# EAGLE design ADAP030 (EAGLE 7.6.0)
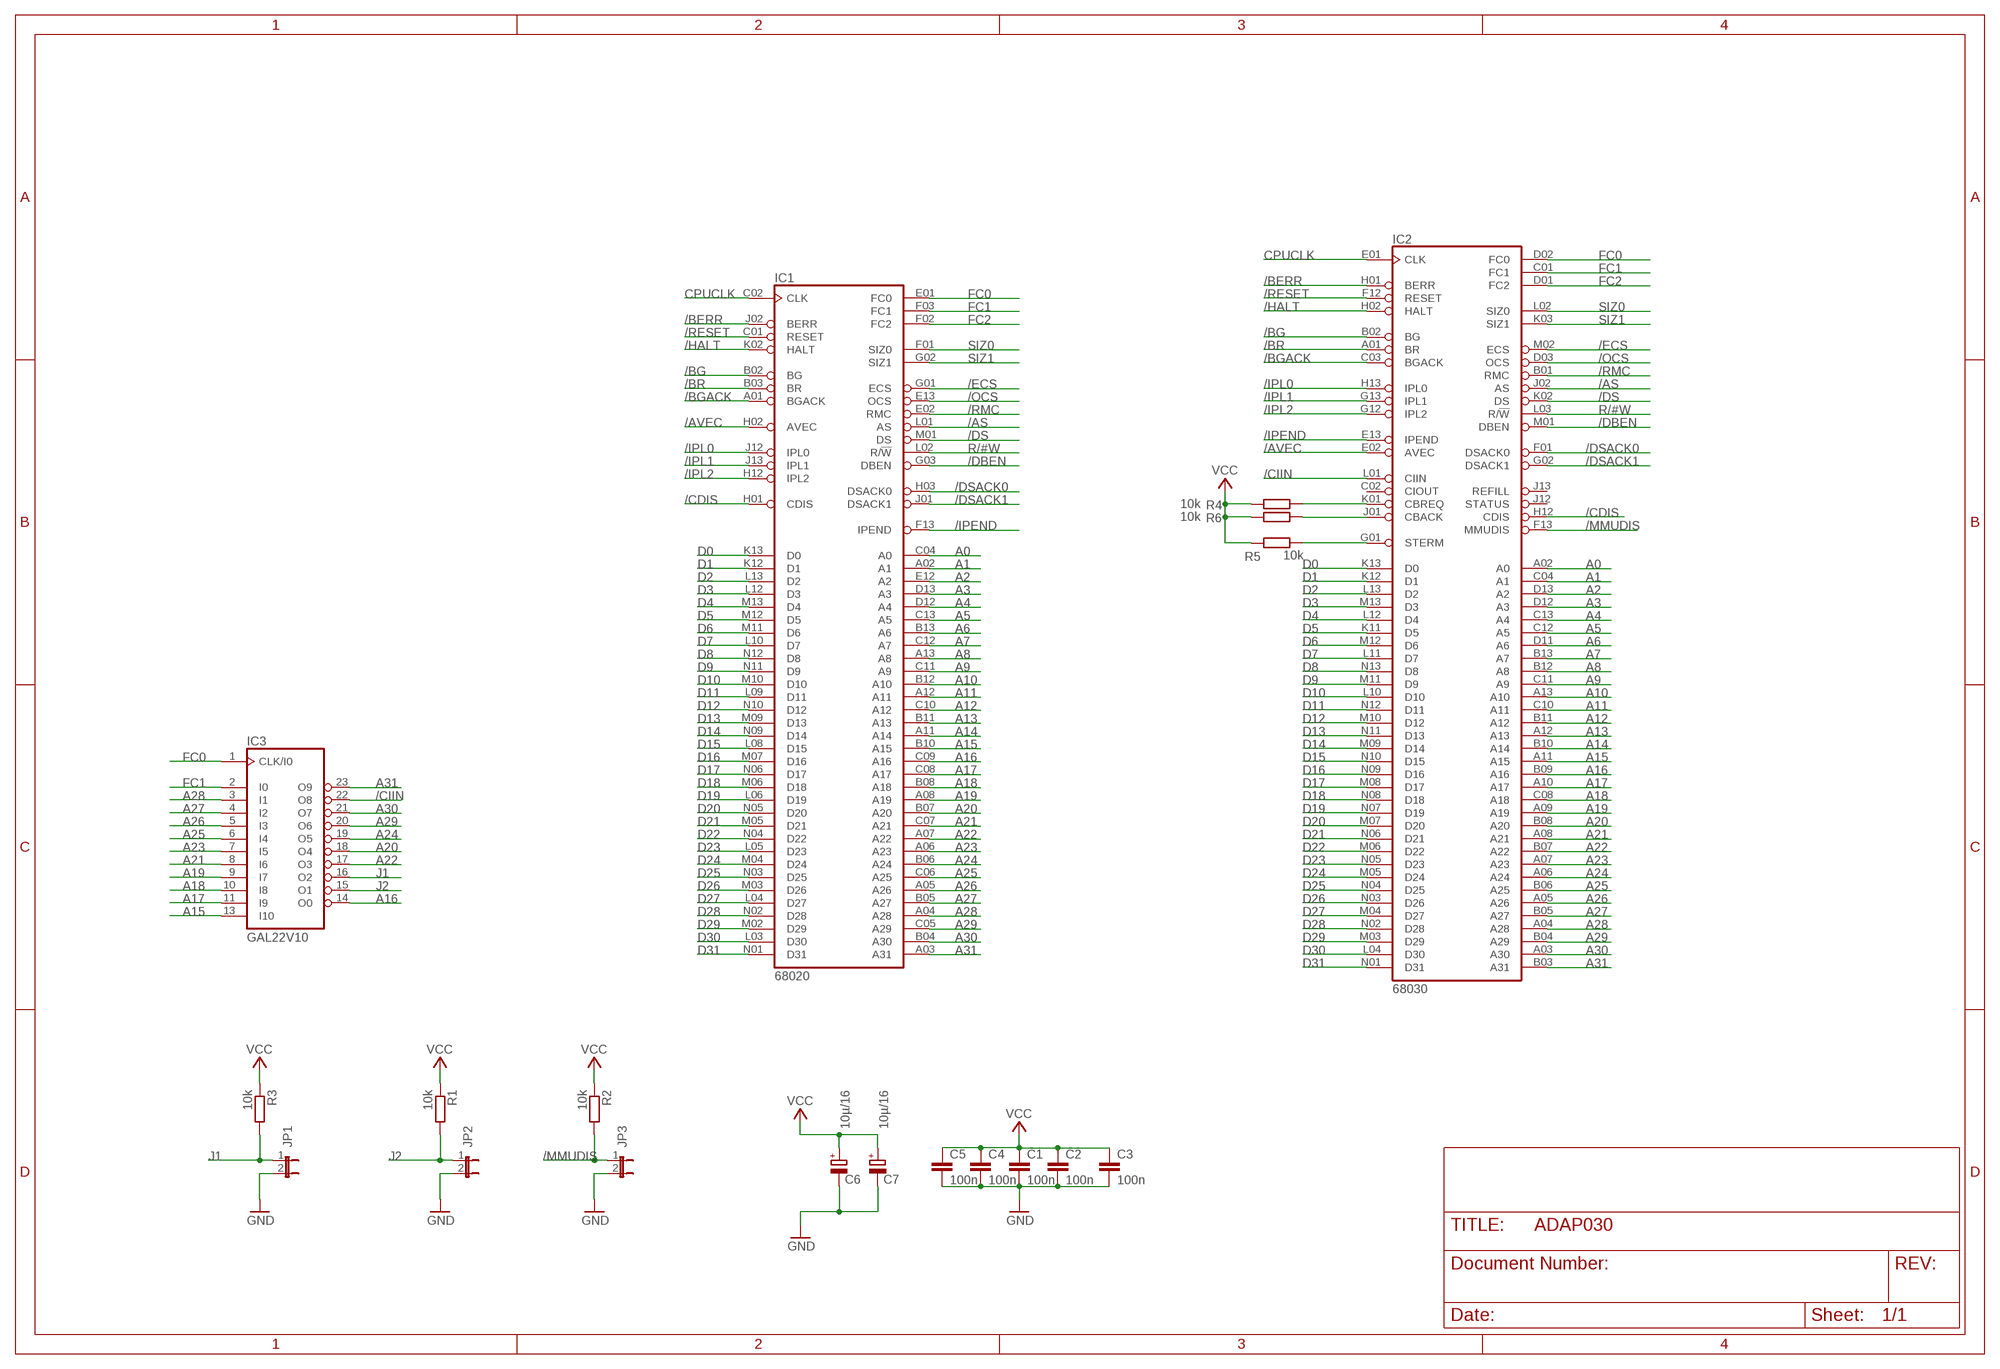
[diagram p0: schematic, sheet 1]

## Parts
C1  100n  C-EUC0603K  [C0603K]
C2  100n  C-EUC0603K  [C0603K]
C3  100n  C-EUC0603K  [C0603K]
C4  100n  C-EUC0603K  [C0603K]
C5  100n  C-EUC0603K  [C0603K]
C6  10µ/16  CPOL-EUSMCC  [SMC_C]
C7  10µ/16  CPOL-EUSMCC  [SMC_C]
IC1  68020  MC68020RC  [MPGA114]
IC2  68030  MC68030RC  [MPGA128]
IC3  GAL22V10  22V10  [DIL24-3]
JP1  JP1E  [JP1]
JP2  JP1E  [JP1]
JP3  JP1E  [JP1]
R1  10k  R-EU_M0805  [M0805]
R2  10k  R-EU_M0805  [M0805]
R3  10k  R-EU_M0805  [M0805]
R4  10k  R-EU_M0805  [M0805]
R5  10k  R-EU_M0805  [M0805]
R6  10k  R-EU_M0805  [M0805]

## Nets
/AS: IC1.L01(AS) IC2.J02(AS)
/AVEC: IC1.H02(AVEC) IC2.E02(AVEC)
/BERR: IC1.J02(BERR) IC2.H01(BERR)
/BG: IC1.B02(BG) IC2.B02(BG)
/BGACK: IC1.A01(BGACK) IC2.C03(BGACK)
/BR: IC1.B03(BR) IC2.A01(BR)
/CDIS: IC1.H01(CDIS) IC2.H12(CDIS)
/CIIN: IC2.L01(CIIN) IC3.22(O8)
/DBEN: IC1.G03(DBEN) IC2.M01(DBEN)
/DS: IC1.M01(DS) IC2.K02(DS)
/DSACK0: IC1.H03(DSACK0) IC2.F01(DSACK0)
/DSACK1: IC1.J01(DSACK1) IC2.G02(DSACK1)
/ECS: IC1.G01(ECS) IC2.M02(ECS)
/HALT: IC1.K02(HALT) IC2.H02(HALT)
/IPEND: IC1.F13(IPEND) IC2.E13(IPEND)
/IPL0: IC1.J12(IPL0) IC2.H13(IPL0)
/IPL1: IC1.J13(IPL1) IC2.G13(IPL1)
/IPL2: IC1.H12(IPL2) IC2.G12(IPL2)
/MMUDIS: IC2.F13(MMUDIS) JP3.1 R2.2
/OCS: IC1.E13(OCS) IC2.D03(OCS)
/RESET: IC1.C01(RESET) IC2.F12(RESET)
/RMC: IC1.E02(RMC) IC2.B01(RMC)
A0: IC1.C04(A0) IC2.A02(A0)
A1: IC1.A02(A1) IC2.C04(A1)
A2: IC1.E12(A2) IC2.D13(A2)
A3: IC1.D13(A3) IC2.D12(A3)
A4: IC1.D12(A4) IC2.C13(A4)
A5: IC1.C13(A5) IC2.C12(A5)
A6: IC1.B13(A6) IC2.D11(A6)
A7: IC1.C12(A7) IC2.B13(A7)
A8: IC1.A13(A8) IC2.B12(A8)
A9: IC1.C11(A9) IC2.C11(A9)
A10: IC1.B12(A10) IC2.A13(A10)
A11: IC1.A12(A11) IC2.C10(A11)
A12: IC1.C10(A12) IC2.B11(A12)
A13: IC1.B11(A13) IC2.A12(A13)
A14: IC1.A11(A14) IC2.B10(A14)
A15: IC1.B10(A15) IC2.A11(A15) IC3.13(I10)
A16: IC1.C09(A16) IC2.B09(A16) IC3.14(O0)
A17: IC1.C08(A17) IC2.A10(A17) IC3.11(I9)
A18: IC1.B08(A18) IC2.C08(A18) IC3.10(I8)
A19: IC1.A08(A19) IC2.A09(A19) IC3.9(I7)
A20: IC1.B07(A20) IC2.B08(A20) IC3.18(O4)
A21: IC1.C07(A21) IC2.A08(A21) IC3.8(I6)
A22: IC1.A07(A22) IC2.B07(A22) IC3.17(O3)
A23: IC1.A06(A23) IC2.A07(A23) IC3.7(I5)
A24: IC1.B06(A24) IC2.A06(A24) IC3.19(O5)
A25: IC1.C06(A25) IC2.B06(A25) IC3.6(I4)
A26: IC1.A05(A26) IC2.A05(A26) IC3.5(I3)
A27: IC1.B05(A27) IC2.B05(A27) IC3.4(I2)
A28: IC1.A04(A28) IC2.A04(A28) IC3.3(I1)
A29: IC1.C05(A29) IC2.B04(A29) IC3.20(O6)
A30: IC1.B04(A30) IC2.A03(A30) IC3.21(O7)
A31: IC1.A03(A31) IC2.B03(A31) IC3.23(O9)
CBACK: IC2.J01(CBACK) R6.2
CNREQ: IC2.K01(CBREQ) R4.2
CPUCLK: IC1.C02(CLK) IC2.E01(CLK)
D0: IC1.K13(D0) IC2.K13(D0)
D1: IC1.K12(D1) IC2.K12(D1)
D2: IC1.L13(D2) IC2.L13(D2)
D3: IC1.L12(D3) IC2.M13(D3)
D4: IC1.M13(D4) IC2.L12(D4)
D5: IC1.M12(D5) IC2.K11(D5)
D6: IC1.M11(D6) IC2.M12(D6)
D7: IC1.L10(D7) IC2.L11(D7)
D8: IC1.N12(D8) IC2.N13(D8)
D9: IC1.N11(D9) IC2.M11(D9)
D10: IC1.M10(D10) IC2.L10(D10)
D11: IC1.L09(D11) IC2.N12(D11)
D12: IC1.N10(D12) IC2.M10(D12)
D13: IC1.M09(D13) IC2.N11(D13)
D14: IC1.N09(D14) IC2.M09(D14)
D15: IC1.L08(D15) IC2.N10(D15)
D16: IC1.M07(D16) IC2.N09(D16)
D17: IC1.N06(D17) IC2.M08(D17)
D18: IC1.M06(D18) IC2.N08(D18)
D19: IC1.L06(D19) IC2.N07(D19)
D20: IC1.N05(D20) IC2.M07(D20)
D21: IC1.M05(D21) IC2.N06(D21)
D22: IC1.N04(D22) IC2.M06(D22)
D23: IC1.L05(D23) IC2.N05(D23)
D24: IC1.M04(D24) IC2.M05(D24)
D25: IC1.N03(D25) IC2.N04(D25)
D26: IC1.M03(D26) IC2.N03(D26)
D27: IC1.L04(D27) IC2.M04(D27)
D28: IC1.N02(D28) IC2.N02(D28)
D29: IC1.M02(D29) IC2.M03(D29)
D30: IC1.L03(D30) IC2.L04(D30)
D31: IC1.N01(D31) IC2.N01(D31)
FC0: IC1.E01(FC0) IC2.D02(FC0) IC3.1(CLK/I0)
FC1: IC1.F03(FC1) IC2.C01(FC1) IC3.2(I0)
FC2: IC1.F02(FC2) IC2.D01(FC2)
GND: C1.2 C2.2 C3.2 C4.2 C5.2 C6.- C7.- JP1.2 JP2.2 JP3.2
J1: IC3.16(O2) JP1.1 R3.2
J2: IC3.15(O1) JP2.1 R1.2
R/#W: IC1.L02(R/!W) IC2.L03(R/!W)
SIZ0: IC1.F01(SIZ0) IC2.L02(SIZ0)
SIZ1: IC1.G02(SIZ1) IC2.K03(SIZ1)
STERM: IC2.G01(STERM) R5.2
VCC: C1.1 C2.1 C3.1 C4.1 C5.1 C6.+ C7.+ R1.1 R2.1 R3.1 R4.1 R5.1 R6.1
Unconnected: IC2.C02(CIOUT) IC2.J12(STATUS) IC2.J13(REFILL)

## Power pins joined to a net without a drawn wire
GND: IC1.A10(GND) IC1.B01(GND) IC1.B09(GND) IC1.C03(GND) IC1.F12(GND) IC1.G12(GND) IC1.H13(GND) IC1.J03(GND) IC1.K01(GND) IC1.K03(GND) IC1.L07(GND) IC1.L11(GND) IC1.N07(GND) IC2.C05(GND) IC2.C07(GND) IC2.C09(GND) IC2.E03(GND) IC2.E11(GND) IC2.F03(GND) IC2.G03(GND) IC2.G11(GND) IC2.J03(GND) IC2.J11(GND) IC2.L05(GND) IC2.L07(GND) IC2.L08(GND) IC2.L09(GND) IC3.12(GND)
VCC: IC1.A09(VCC) IC1.D01(VCC) IC1.D02(VCC) IC1.D03(VCC) IC1.E03(VCC) IC1.G11(VCC) IC1.G13(VCC) IC1.M08(VCC) IC1.N08(VCC) IC1.N13(VCC) IC2.C06(VCC) IC2.D04(VCC) IC2.D10(VCC) IC2.F02(VCC) IC2.F11(VCC) IC2.H03(VCC) IC2.H11(VCC) IC2.K04(VCC) IC2.K10(VCC) IC2.L06(VCC) IC3.24(VCC)

## Library data of the parts
C1-C5 = rcl:C-EU: CAPACITOR, European symbol
C6 C7 = rcl:CPOL-EU: POLARIZED CAPACITOR, European symbol
IC1 = micro-mc68000:MC68020RC: 68xxx PROCESSOR
IC2 = micro-mc68000:MC68030RC: 68xxx PROCESSOR; MF: MOTOROLA; MPN: MC68030RC50C; OC_FARNELL: unknown; OC_NEWARK: 52F3269
IC3 = pal:22V10: PAL; MPN: GAL22V10D-7LPN; OC_FARNELL: 1571925; OC_NEWARK: 97M0480
JP1-JP3 = jumper:JP1E: JUMPER
R1-R6 = rcl:R-EU_: RESISTOR, European symbol

## Board
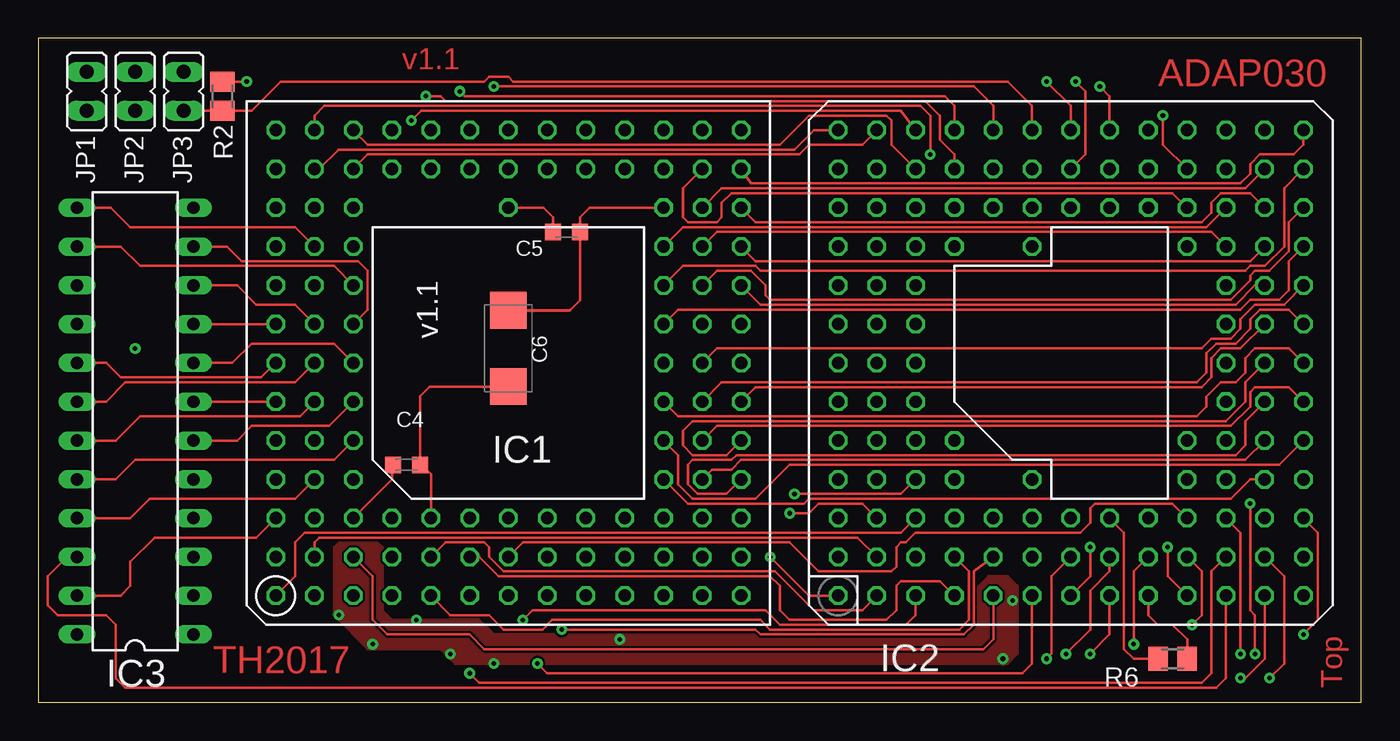
[diagram p1: board, top side]
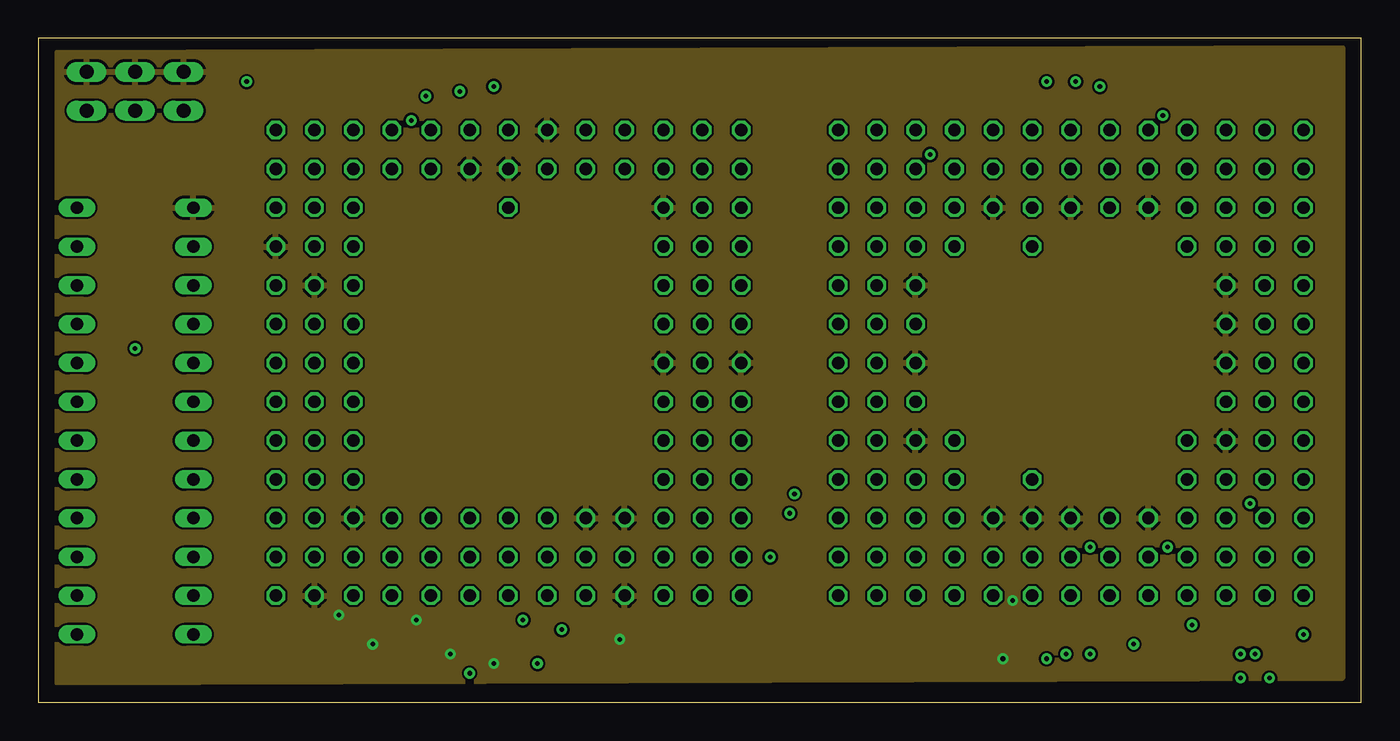
[diagram p2: board, inner layer GND]
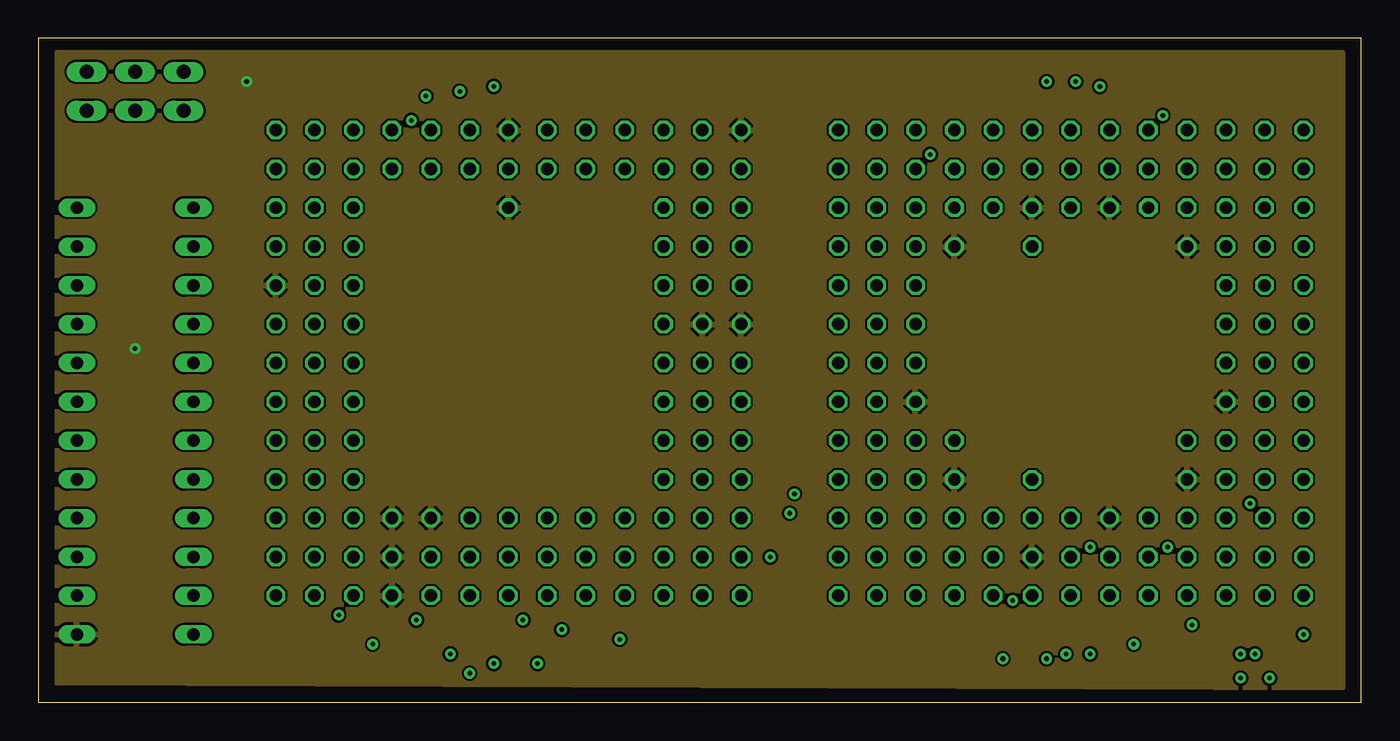
[diagram p3: board, inner layer VCC]
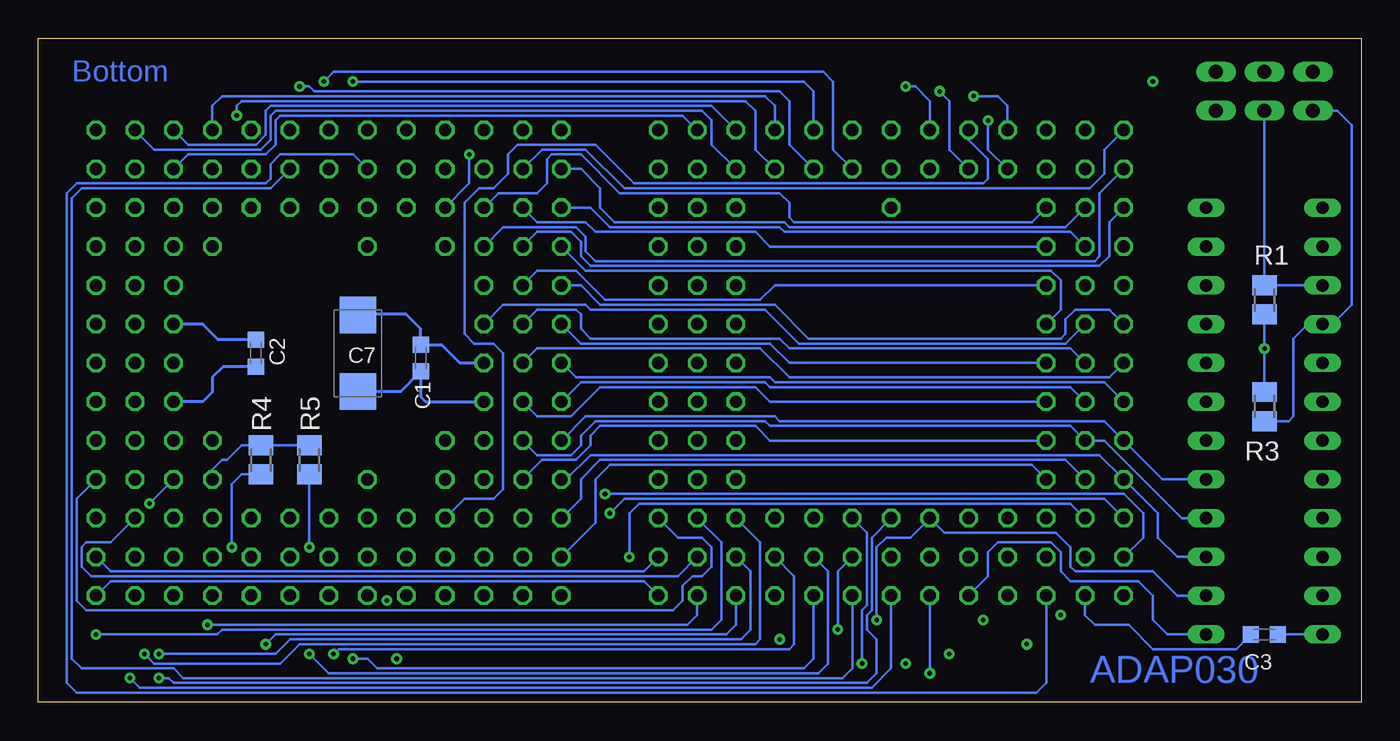
[diagram p4: board, bottom side, seen from below]

Size 86.66 x 43.48 mm. Coordinates in mm from the lower left corner, seen from the top.
Outline: 0,0 86.66,0 86.66,43.48 0,43.48 0,0
Copper layers (1*2*3*16): Top 0.018mm / dielectric 0.36mm / GND 0.035mm / dielectric 0.71mm / VCC 0.035mm / dielectric 0.36mm / Bottom 0.018mm
Design rules "eC-PCB_proto-4-layer": minimum track width 0.15mm, minimum drill 0.25mm, track to track 0.15mm, track to pad 0.15mm, pad to pad 0.15mm, via to via 0.15mm, smd to smd 0.15mm, copper to edge 0.45mm, drill to drill 0.3mm, minimum pad ring 0.2mm, minimum via ring 0.2mm, stop-mask expansion 0.1mm, vias tented up to drill 0mil, thermal gap 0.2mm

### Footprints (pad centres in the part's own frame; a part is rotated, then mirrored left to right if it is on the bottom)
C0603K = smd 1.05 x 1.08: 1 -0.875,0; 2 0.875,0
SMC_C = smd 2.4 x 2.4: + -2.5,0; - 2.5,0
MPGA114 = drill 0.813 octagon: A01 -15.24,15.24; A02 -12.7,15.24; A03 -10.16,15.24; A04 -7.62,15.24; A05 -5.08,15.24; A06 -2.54,15.24; A07 0,15.24; A08 2.54,15.24; A09 5.08,15.24; A10 7.62,15.24; A11 10.16,15.24; A12 12.7,15.24; A13 15.24,15.24; B01 -15.24,12.7; B02 -12.7,12.7; B03 -10.16,12.7; B04 -7.62,12.7; B05 -5.08,12.7; B06 -2.54,12.7; B07 0,12.7; B08 2.54,12.7; B09 5.08,12.7; B10 7.62,12.7; B11 10.16,12.7; B12 12.7,12.7; B13 15.24,12.7; C01 -15.24,10.16; C02 -12.7,10.16; C03 -10.16,10.16; C04 -7.62,10.16; C05 -5.08,10.16; C06 -2.54,10.16; C07 0,10.16; C08 2.54,10.16; C09 5.08,10.16; C10 7.62,10.16; C11 10.16,10.16; C12 12.7,10.16; C13 15.24,10.16; D01 -15.24,7.62; D02 -12.7,7.62; D03 -10.16,7.62; D12 12.7,7.62; D13 15.24,7.62; E01 -15.24,5.08; E02 -12.7,5.08; E03 -10.16,5.08; E12 12.7,5.08; E13 15.24,5.08; F01 -15.24,2.54; F02 -12.7,2.54; F03 -10.16,2.54; F12 12.7,2.54; F13 15.24,2.54; G01 -15.24,0; G02 -12.7,0; G03 -10.16,0; G11 10.16,0; G12 12.7,0; G13 15.24,0; H01 -15.24,-2.54; H02 -12.7,-2.54; H03 -10.16,-2.54; H12 12.7,-2.54; H13 15.24,-2.54; J01 -15.24,-5.08; J02 -12.7,-5.08; J03 -10.16,-5.08; J12 12.7,-5.08; J13 15.24,-5.08; K01 -15.24,-7.62; K02 -12.7,-7.62; K03 -10.16,-7.62; K12 12.7,-7.62; K13 15.24,-7.62; L01 -15.24,-10.16; L02 -12.7,-10.16; L03 -10.16,-10.16; L04 -7.62,-10.16; L05 -5.08,-10.16; L06 -2.54,-10.16; L07 0,-10.16; L08 2.54,-10.16; L09 5.08,-10.16; L10 7.62,-10.16; L11 10.16,-10.16; L12 12.7,-10.16; L13 15.24,-10.16; M01 -15.24,-12.7; M02 -12.7,-12.7; M03 -10.16,-12.7; M04 -7.62,-12.7; M05 -5.08,-12.7; M06 -2.54,-12.7; M07 0,-12.7; M08 2.54,-12.7; M09 5.08,-12.7; M10 7.62,-12.7; M11 10.16,-12.7; M12 12.7,-12.7; M13 15.24,-12.7; N01 -15.24,-15.24; N02 -12.7,-15.24; N03 -10.16,-15.24; N04 -7.62,-15.24; N05 -5.08,-15.24; N06 -2.54,-15.24; N07 0,-15.24; N08 2.54,-15.24; N09 5.08,-15.24; N10 7.62,-15.24; N11 10.16,-15.24; N12 12.7,-15.24; N13 15.24,-15.24
MPGA128 = drill 0.813 octagon: A01 -15.24,15.24; A02 -12.7,15.24; A03 -10.16,15.24; A04 -7.62,15.24; A05 -5.08,15.24; A06 -2.54,15.24; A07 0,15.24; A08 2.54,15.24; A09 5.08,15.24; A10 7.62,15.24; A11 10.16,15.24; A12 12.7,15.24; A13 15.24,15.24; B01 -15.24,12.7; B02 -12.7,12.7; B03 -10.16,12.7; B04 -7.62,12.7; B05 -5.08,12.7; B06 -2.54,12.7; B07 0,12.7; B08 2.54,12.7; B09 5.08,12.7; B10 7.62,12.7; B11 10.16,12.7; B12 12.7,12.7; B13 15.24,12.7; C01 -15.24,10.16; C02 -12.7,10.16; C03 -10.16,10.16; C04 -7.62,10.16; C05 -5.08,10.16; C06 -2.54,10.16; C07 0,10.16; C08 2.54,10.16; C09 5.08,10.16; C10 7.62,10.16; C11 10.16,10.16; C12 12.7,10.16; C13 15.24,10.16; D01 -15.24,7.62; D02 -12.7,7.62; D03 -10.16,7.62; D04 -7.62,7.62; D05 -5.08,7.62; D10 7.62,7.62; D11 10.16,7.62; D12 12.7,7.62; D13 15.24,7.62; E01 -15.24,5.08; E02 -12.7,5.08; E03 -10.16,5.08; E11 10.16,5.08; E12 12.7,5.08; E13 15.24,5.08; F01 -15.24,2.54; F02 -12.7,2.54; F03 -10.16,2.54; F04 -7.62,2.54; F10 7.62,2.54; F11 10.16,2.54; F12 12.7,2.54; F13 15.24,2.54; G01 -15.24,0; G02 -12.7,0; G03 -10.16,0; G11 10.16,0; G12 12.7,0; G13 15.24,0; H01 -15.24,-2.54; H02 -12.7,-2.54; H03 -10.16,-2.54; H11 10.16,-2.54; H12 12.7,-2.54; H13 15.24,-2.54; J01 -15.24,-5.08; J02 -12.7,-5.08; J03 -10.16,-5.08; J11 10.16,-5.08; J12 12.7,-5.08; J13 15.24,-5.08; K01 -15.24,-7.62; K02 -12.7,-7.62; K03 -10.16,-7.62; K04 -7.62,-7.62; K05 -5.08,-7.62; K10 7.62,-7.62; K11 10.16,-7.62; K12 12.7,-7.62; K13 15.24,-7.62; L01 -15.24,-10.16; L02 -12.7,-10.16; L03 -10.16,-10.16; L04 -7.62,-10.16; L05 -5.08,-10.16; L06 -2.54,-10.16; L07 0,-10.16; L08 2.54,-10.16; L09 5.08,-10.16; L10 7.62,-10.16; L11 10.16,-10.16; L12 12.7,-10.16; L13 15.24,-10.16; M01 -15.24,-12.7; M02 -12.7,-12.7; M03 -10.16,-12.7; M04 -7.62,-12.7; M05 -5.08,-12.7; M06 -2.54,-12.7; M07 0,-12.7; M08 2.54,-12.7; M09 5.08,-12.7; M10 7.62,-12.7; M11 10.16,-12.7; M12 12.7,-12.7; M13 15.24,-12.7; N01 -15.24,-15.24; N02 -12.7,-15.24; N03 -10.16,-15.24; N04 -7.62,-15.24; N05 -5.08,-15.24; N06 -2.54,-15.24; N07 0,-15.24; N08 2.54,-15.24; N09 5.08,-15.24; N10 7.62,-15.24; N11 10.16,-15.24; N12 12.7,-15.24; N13 15.24,-15.24
DIL24-3 = drill 0.813 long: 1 -13.97,-3.81; 2 -11.43,-3.81; 3 -8.89,-3.81; 4 -6.35,-3.81; 5 -3.81,-3.81; 6 -1.27,-3.81; 7 1.27,-3.81; 8 3.81,-3.81; 9 6.35,-3.81; 10 8.89,-3.81; 11 11.43,-3.81; 12 13.97,-3.81; 13 13.97,3.81; 14 11.43,3.81; 15 8.89,3.81; 16 6.35,3.81; 17 3.81,3.81; 18 1.27,3.81; 19 -1.27,3.81; 20 -3.81,3.81; 21 -6.35,3.81; 22 -8.89,3.81; 23 -11.43,3.81; 24 -13.97,3.81
JP1 = drill 0.914 long: 1 0,-1.27; 2 0,1.27
M0805 = smd 1.3 x 1.6: 1 -0.95,0; 2 0.95,0

### Placement (x,y rotation side)
C1  61.59,22.54 90 bottom
C2  72.39,22.86 90 bottom
C3  6.35,4.45 180 bottom
C4  24.13,15.56 180 top
C5  34.61,30.8 0 top
C6  30.8,23.18 90 top
C7  65.72,22.86 90 bottom
IC1  30.8,22.23 90 top
IC2  67.63,22.23 90 top
IC3  6.35,18.41 90 top
JP1  3.17,40.01 0 top
JP2  6.35,40.01 0 top
JP3  9.53,40.01 0 top
R1  6.35,26.35 90 bottom
R2  12.06,39.69 270 top
R3  6.35,19.37 270 bottom
R4  72.07,15.88 270 bottom
R5  68.9,15.88 270 bottom
R6  74.3,2.86 0 top

### Tracks (layer width: path | path; a pad name or v marks a point on that pad's centre or on a via)
/AS  (via drill 0.3)
  Top 0.15: v71.75,3.81 71.75,8.57 IC2.J02
  Bottom 0.15: IC1.L01 40.96,5.08 41.59,4.45 71.12,4.45 v71.75,3.81
/AVEC  (via drill 0.3)
  Top 0.15: v34.29,4.76 46.99,4.76 47.31,4.45 60.64,4.45 61.28,5.08 61.28,8.57 IC2.E02
  Bottom 0.15: IC1.H02 34.29,8.57 v34.29,4.76
/BERR  (via drill 0.3)
  Top 0.15: v68.9,3.17 70.17,4.45 IC2.H01
  Bottom 0.15: IC1.J02 34.92,8.57 34.92,2.54 35.56,1.91 67.63,1.91 v68.9,3.17
/BG
  Top 0.15: IC1.B02 18.1,10.48 18.41,10.79 53.66,10.79 IC2.B02
/BGACK
  Top 0.15: IC1.A01 16.83,8.26 16.83,10.48 17.46,11.11 56.52,11.11 IC2.C03
/BR  (via drill 0.3)
  Top 0.15: v47.94,9.53 50.48,6.99 IC2.A01
  Bottom 0.15: IC1.B03 19.05,13.02 47.31,13.02 47.94,12.38 v47.94,9.53
/CDIS
  Bottom 0.15: IC1.H01 33.34,2.22 33.97,1.59 77.15,1.59 77.79,2.22 83.82,2.22 84.45,2.86 84.45,33.02 83.82,33.66 71.44,33.66 IC2.H12
/CIIN
  Top 0.15: IC2.L01 77.79,1.59 77.15,0.95 5.71,0.95 5.08,1.59 5.08,5.08 4.45,5.71 1.27,5.71 0.64,6.35 0.64,8.26 1.91,9.53 IC3.22
/DBEN  (via drill 0.3)
  Top 0.15: v78.74,1.59 79.06,1.59 80.33,2.86 IC2.M01
  Bottom 0.15: IC1.G03 32.07,10.79 32.07,6.03 32.38,5.71 32.38,4.76 31.75,4.13 31.75,1.91 32.38,1.27 77.79,1.27 78.11,1.59 v78.74,1.59
/DS  (via drill 0.3)
  Top 0.15: v75.56,5.08 76.2,5.71 76.2,8.57 IC2.K02
  Bottom 0.15: IC1.M01 43.5,5.71 44.13,5.08 v75.56,5.08
/DSACK0  (via drill 0.3)
  Top 0.15: v32.7,2.54 33.34,1.91 64.45,1.91 65.09,2.54 IC2.F01
  Bottom 0.15: IC1.H03 32.38,11.11 32.38,6.35 32.7,6.03 v32.7,2.54
/DSACK1  (via drill 0.3)
  Top 0.15: v66.04,2.86 66.36,3.17 66.36,8.26 IC2.G02
  Bottom 0.15: IC1.J01 35.88,2.86 36.51,2.22 64.45,2.22 65.09,2.86 v66.04,2.86
/ECS  (via drill 0.3)
  Top 0.15: v80.64,1.59 81.6,2.54 81.6,8.26 IC2.M02
  Bottom 0.15: IC1.G01 30.8,2.22 32.07,0.95 80.01,0.95 v80.64,1.59
/HALT  (via drill 0.3)
  Top 0.15: v67.31,3.17 68.9,4.76 68.9,7.3 70.17,8.57 IC2.H02
  Bottom 0.15: IC1.K02 37.15,8.26 37.15,3.81 37.47,3.49 66.99,3.49 v67.31,3.17
/IPEND  (via drill 0.3)
  Top 0.15: IC2.E13 62.55,39.05 61.28,40.32 v29.84,40.32
  Bottom 0.15: v29.84,40.32 29.21,40.32 28.26,39.37 IC1.F13
/IPL0  (via drill 0.3)
  Top 0.15: IC2.H13 70.17,39.69 v69.53,40.32
  Bottom 0.15: IC1.J12 37.47,36.51 37.47,39.37 38.1,40.01 68.58,40.01 68.9,40.32 v69.53,40.32
/IPL1  (via drill 0.3)
  Top 0.15: IC2.G13 67.63,39.05 v66.04,40.64
  Bottom 0.15: IC1.J13 35.88,40.01 36.51,40.64 v66.04,40.64
/IPL2  (via drill 0.3)
  Top 0.15: IC2.G12 68.58,35.88 68.58,40.01 v67.94,40.64
  Bottom 0.15: IC1.H12 34.61,36.2 34.61,40.64 35.24,41.27 67.31,41.27 v67.94,40.64
/MMUDIS
  Top 0.15: IC2.F13 65.09,39.05 63.5,40.64 31.11,40.64 30.8,40.96 29.53,40.96 29.21,40.64 15.88,40.64 13.97,38.73 11.75,38.73 | 11.75,38.73 R2.2 | 11.75,38.73 JP3.1
/OCS
  Bottom 0.15: IC1.E13 25.72,36.83 24.45,35.56 24.45,34.29 24.77,33.97 47.62,33.97 50.16,36.51 55.24,36.51 55.88,35.88 55.88,34.61 56.83,33.66 57.78,33.66 58.74,32.7 58.74,24.13 58.1,23.5 56.83,23.5 56.2,22.86 56.2,13.97 56.83,13.34 58.74,13.34 IC2.D03
/RESET
  Bottom 0.15: IC1.C01 20.64,1.27 21.27,0.64 84.14,0.64 84.77,1.27 84.77,33.34 84.14,33.97 71.75,33.97 71.44,34.29 71.44,35.24 70.8,35.88 66.04,35.88 IC2.F12
/RMC
  Top 0.15: IC1.E02 26.67,10.48 29.21,10.48 29.53,10.16 29.53,9.53 30.48,8.57 48.26,8.57 50.8,6.03 53.98,6.03 IC2.B01
A0
  Bottom 0.15: IC1.C04 21.59,15.56 49.21,15.56 50.16,14.61 50.16,11.75 IC2.A02
A1  (via drill 0.3)
  Top 0.15: v49.53,13.65 56.52,13.65 IC2.C04
  Bottom 0.15: v49.53,13.65 15.56,13.65 14.29,12.38 14.29,10.79 IC1.A02
A2  (via drill 0.3)
  Top 0.15: IC2.D13 60.01,39.05 59.37,39.69 27.94,39.69 v27.62,40.01
  Bottom 0.15: v27.62,40.01 26.99,39.37 26.99,36.2 IC1.E12
A3  (via drill 0.3)
  Top 0.15: IC2.D12 60.01,35.88 59.05,36.83 59.05,38.42 58.1,39.37 26.67,39.37 26.35,39.69 v25.4,39.69
  Bottom 0.15: v25.4,39.69 23.81,39.69 23.18,39.05 IC1.D13
A4  (via drill 0.3)
  Top 0.15: IC2.C13 56.52,38.73 25.08,38.73 v24.45,38.1
  Bottom 0.15: v24.45,38.1 24.45,36.2 IC1.D12
A5
  Top 0.15: IC2.C12 55.88,36.51 55.88,38.1 55.56,38.42 50.48,38.42 48.58,36.51 21.59,36.51 IC1.C13
A6  (via drill 0.3)
  Top 0.15: v58.42,35.88 58.42,38.42 57.78,39.05 18.73,39.05 18.1,38.42 IC1.B13
  Bottom 0.15: IC2.D11 58.42,33.97 v58.42,35.88
A7
  Top 0.15: IC1.C12 21.59,35.88 49.85,35.88 50.48,36.51 53.98,36.51 IC2.B13
A8
  Bottom 0.15: IC1.A13 16.83,36.2 16.83,34.61 17.78,33.66 48.26,33.66 50.8,36.2 53.66,36.2 IC2.B12
A9
  Bottom 0.15: IC1.C11 21.59,31.43 37.15,31.43 37.47,31.75 37.47,32.7 38.1,33.34 48.58,33.34 51.12,35.88 53.02,35.88 53.34,35.56 53.34,33.97 53.98,33.34 56.52,33.34 IC2.C11
A10
  Top 0.15: IC1.B12 18.41,34.92 19.68,36.2 49.53,36.2 50.8,37.47 IC2.A13
A11
  Bottom 0.15: IC1.A12 17.14,33.34 17.14,29.21 17.46,28.89 50.16,28.89 50.8,29.53 50.8,30.48 51.44,31.11 56.2,31.11 IC2.C10
A12
  Bottom 0.15: IC1.C10 38.73,29.84 39.69,30.8 50.16,30.8 50.8,31.43 53.98,31.43 IC2.B11
A13
  Bottom 0.15: IC1.B11 19.37,31.11 37.47,31.11 37.78,31.43 48.9,31.43 49.85,32.38 49.85,33.66 51.12,34.92 IC2.A12
A14
  Bottom 0.15: IC2.B10 53.98,30.8 51.75,30.8 51.12,30.16 51.12,29.21 50.48,28.57 17.14,28.57 16.51,29.21 16.51,31.43 IC1.A11
A15
  Top 0.15: IC1.B10 16.83,31.11 6.03,31.11 4.76,32.38 IC3.13
  Bottom 0.15: IC1.B10 19.05,30.8 37.78,30.8 38.1,31.11 49.21,31.11 50.48,32.38 IC2.A11
A16
  Top 0.15: IC1.C09 19.37,28.57 6.67,28.57 5.4,29.84 IC3.14
  Bottom 0.15: IC1.C09 38.42,27.3 39.37,26.35 49.53,26.35 51.44,28.26 53.98,28.26 IC2.B09
A17
  Top 0.15: IC3.11 12.38,29.84 13.34,28.89 20.95,28.89 21.59,28.26 21.59,25.72 IC1.C08
  Bottom 0.15: IC1.C08 19.68,25.72 19.68,27.62 20.32,28.26 50.8,28.26 IC2.A10
A18
  Top 0.15: IC1.B08 16.83,26.04 14.29,26.04 13.02,27.3 IC3.10
  Bottom 0.15: IC1.B08 19.37,23.5 36.83,23.5 39.05,25.72 50.48,25.72 50.8,26.04 56.2,26.04 IC2.C08
A19
  Top 0.15: IC1.A08 IC3.9
  Bottom 0.15: IC1.A08 16.51,25.72 18.73,25.72 19.37,25.08 19.37,24.13 19.68,23.81 36.2,23.81 38.42,26.04 49.85,26.04 51.12,27.3 IC2.A09
A20
  Top 0.15: IC1.B07 16.83,20.95 5.71,20.95 4.45,19.68 IC3.18
  Bottom 0.15: IC1.B07 19.05,23.18 37.47,23.18 38.1,23.81 50.48,23.81 51.12,24.45 51.12,25.4 51.44,25.72 53.98,25.72 IC2.B08
A21
  Top 0.15: IC1.C07 19.37,23.5 13.97,23.5 12.7,22.23 IC3.8
  Bottom 0.15: IC1.C07 37.47,22.23 38.73,23.5 51.12,23.5 IC2.A08
A22
  Top 0.15: IC1.A07 14.61,21.27 5.4,21.27 4.45,22.23 IC3.17
  Bottom 0.15: IC1.A07 16.51,21.27 37.47,21.27 39.37,23.18 53.98,23.18 IC2.B07
A23
  Top 0.15: IC1.A06 IC3.7
  Bottom 0.15: IC1.A06 16.83,20.95 38.42,20.95 38.73,21.27 51.44,21.27 IC2.A07
A24
  Top 0.15: IC1.B06 17.14,18.73 6.67,18.73 5.08,17.14 IC3.19
  Bottom 0.15: IC1.B06 19.05,20.64 38.73,20.64 39.05,20.95 51.12,20.95 IC2.A06
A25
  Top 0.15: IC1.C06 19.05,18.1 13.97,18.1 13.02,17.14 IC3.6
  Bottom 0.15: IC1.C06 38.73,19.68 39.69,20.64 49.85,20.64 51.75,18.73 53.98,18.73 IC2.B06
A26
  Bottom 0.15: IC2.A05 50.8,18.73 38.42,18.73 38.1,18.41 16.83,18.41 IC1.A05 13.02,14.61 IC3.5
A27
  Bottom 0.15: IC2.B05 53.98,16.19 51.75,16.19 51.12,16.83 51.12,17.46 50.16,18.41 39.05,18.41 38.73,18.1 19.05,18.1 IC1.B05 16.83,17.14 11.75,12.06 IC3.4
A28
  Bottom 0.15: IC2.A04 52.07,14.61 50.48,16.19 17.14,16.19 IC1.A04 13.34,12.38 13.34,10.79 12.06,9.53 IC3.3
A29
  Top 0.15: IC1.C05 19.37,15.88 6.35,15.88 5.08,14.61 IC3.20
  Bottom 0.15: IC1.C05 38.73,17.14 39.69,18.1 49.85,18.1 50.48,17.46 50.48,16.83 51.44,15.88 53.66,15.88 IC2.B04
A30
  Top 0.15: IC1.B04 16.83,13.34 7.3,13.34 6.03,12.06 IC3.21
  Bottom 0.15: IC1.B04 19.37,15.88 49.85,15.88 51.12,14.61 51.12,13.34 IC2.A03
A31  (via drill 0.3)
  Top 0.15: v49.21,12.38 50.48,12.38 51.12,13.02 53.98,13.02 IC2.B03 | IC1.A03 14.29,10.79 7.62,10.79 6.03,9.21 6.03,7.62 5.4,6.99 IC3.23
  Bottom 0.15: IC1.A03 16.83,13.34 48.26,13.34 v49.21,12.38
CBACK
  Top 0.15: IC2.J01 72.71,5.71 73.34,5.08 74.3,5.08 75.25,4.13 R6.2
CNREQ  (via drill 0.3)
  Top 0.15: v73.98,10.16 73.98,8.26 IC2.K01
  Bottom 0.15: R4.2 73.34,14.92 73.98,14.29 v73.98,10.16
CPUCLK
  Top 0.15: IC1.C02 21.91,8.26 21.91,5.4 22.86,4.45 28.26,4.45 29.21,3.49 61.91,3.49 62.55,4.13 IC2.E01
D0
  Bottom 0.15: IC2.K13 75.25,39.05 74.61,39.69 39.05,39.69 38.42,39.05 IC1.K13
D1  (via drill 0.3)
  Top 0.15: IC2.K12 73.66,36.51 v73.66,38.42
  Bottom 0.15: IC1.K12 39.69,36.2 39.69,38.73 40.32,39.37 73.34,39.37 73.66,39.05 v73.66,38.42
D2
  Bottom 0.15: IC1.L13 42.55,39.05 71.44,39.05 71.75,38.73 71.75,37.15 72.39,36.51 76.83,36.51 IC2.L13
D3
  Bottom 0.15: IC1.L12 42.55,36.51 42.55,38.1 43.18,38.73 71.12,38.73 71.44,38.42 71.44,36.83 72.07,36.2 79.06,36.2 IC2.M13
D4
  Bottom 0.15: IC1.M13 44.45,38.42 70.8,38.42 71.12,38.1 71.12,36.51 71.75,35.88 76.83,35.88 IC2.L12
D5
  Top 0.15: IC2.K11 74.3,33.34 45.4,33.34 44.77,32.7 44.77,31.75 44.45,31.43 42.55,31.43 42.23,31.75 42.23,33.66 IC1.M12
D6
  Top 0.15: IC1.M11 44.77,33.66 79.06,33.66 IC2.M12
D7
  Top 0.15: IC1.L10 42.23,31.11 76.52,31.11 IC2.L11
D8
  Top 0.15: IC1.N12 46.67,33.97 78.74,33.97 79.38,34.61 79.38,35.24 80.01,35.88 82.23,35.88 82.87,36.51 IC2.N13
D9
  Top 0.15: IC1.N11 46.99,31.43 76.2,31.43 76.83,32.07 76.83,32.7 77.47,33.34 79.38,33.34 IC2.M11
D10
  Top 0.15: IC1.M10 44.45,30.8 76.83,30.8 IC2.L10
D11
  Top 0.15: IC1.L09 42.23,28.57 46.99,28.57 47.31,28.26 79.06,28.26 79.38,28.57 80.33,28.57 81.6,29.84 81.6,33.66 IC2.N12
D12
  Top 0.15: IC1.N10 46.99,28.89 79.38,28.89 IC2.M10
D13
  Top 0.15: IC2.N11 81.92,31.43 81.92,29.53 80.64,28.26 79.69,28.26 79.38,27.94 79.38,27.62 78.11,26.35 47.94,26.35 47.62,26.67 47.62,27.3 46.67,28.26 44.45,28.26 IC1.M09
D14
  Top 0.15: IC1.N09 47.31,26.04 78.42,26.04 79.69,27.3 IC2.M09
D15
  Top 0.15: IC1.L08 41.91,25.72 78.74,25.72 79.38,26.35 81.28,26.35 81.92,26.99 81.92,28.89 IC2.N10
D16
  Top 0.15: IC1.M07 44.45,23.18 76.2,23.18 76.83,23.81 78.11,23.81 78.74,24.45 78.74,25.08 79.69,26.04 81.6,26.04 IC2.N09
D17
  Top 0.15: IC1.N06 46.99,20.64 76.2,20.64 76.83,21.27 76.83,22.54 77.47,23.18 78.74,23.18 IC2.M08
D18
  Top 0.15: IC1.M06 44.77,20.95 75.88,20.95 76.52,21.59 76.52,22.86 77.15,23.5 78.42,23.5 79.38,24.45 79.38,25.08 80.01,25.72 81.92,25.72 IC2.N08
D19
  Top 0.15: IC1.L06 41.91,18.73 75.88,18.73 76.52,19.37 76.52,20 77.47,20.95 78.42,20.95 79.06,21.59 79.06,22.54 79.69,23.18 81.92,23.18 IC2.N07
D20
  Top 0.15: IC1.N05 45.09,16.19 42.86,16.19 42.23,16.83 42.23,17.78 42.86,18.41 77.79,18.41 79.06,19.68 79.06,20.95 IC2.M07
D21
  Top 0.15: IC1.M05 44.45,18.1 78.11,18.1 79.38,19.37 79.38,20.32 79.69,20.64 81.92,20.64 IC2.N06
D22
  Top 0.15: IC1.N04 45.09,13.65 43.18,13.65 42.55,14.29 42.55,15.56 42.86,15.88 45.4,15.88 45.72,16.19 78.42,16.19 79.06,16.83 79.06,18.41 IC2.M06
D23
  Top 0.15: IC2.N05 81.28,15.56 49.21,15.56 46.99,13.34 42.86,13.34 41.91,14.29 41.91,16.19 IC1.L05
D24
  Top 0.15: IC2.M05 79.06,15.88 46.04,15.88 45.4,15.24 44.13,15.24 IC1.M04
D25
  Bottom 0.15: IC2.N04 84.14,13.34 84.14,6.67 83.5,6.03 45.09,6.03 44.45,6.67 44.45,7.62 43.81,8.26 43.18,8.26 42.55,8.89 42.55,10.16 43.18,10.79 44.77,10.79 IC1.N03
D26  (via drill 0.3)
  Top 0.15: v82.87,4.45 83.82,5.4 83.82,11.11 IC2.N03
  Bottom 0.15: IC1.M03 41.91,10.48 41.91,5.4 42.55,4.76 74.61,4.76 74.93,4.45 v82.87,4.45
D27
  Top 0.15: IC1.L04 42.55,13.02 50.16,13.02 50.48,13.34 78.11,13.34 79.38,14.61 IC2.M04
D28
  Bottom 0.15: IC1.N02 46.99,8.57 81.92,8.57 IC2.N02
D29
  Bottom 0.15: IC1.M02 44.77,8.26 83.19,8.26 83.82,8.89 83.82,10.16 83.5,10.48 81.92,10.48 IC2.M03
D30  (via drill 0.3)
  Top 0.15: v79.69,3.17 79.69,5.71 79.38,6.03 v79.38,13.02
  Bottom 0.15: IC1.L03 39.37,10.48 39.37,4.13 39.69,3.81 69.53,3.81 70.8,2.54 79.06,2.54 v79.69,3.17 | v79.38,13.02 IC2.L04
D31
  Bottom 0.15: IC1.N01 46.99,7.94 81.92,7.94 IC2.N01
FC0
  Top 0.15: IC2.D02 60.96,8.57 60.96,5.4 60.33,4.76 47.94,4.76 47.31,5.4 33.66,5.4 33.02,4.76 30.48,4.76 29.53,5.71 26.99,5.71 IC1.E01
  Bottom 0.15: IC1.E01 24.45,8.26 24.45,9.84 23.81,10.48 20.32,10.48 19.68,9.84 19.68,8.57 19.05,7.94 14.61,7.94 13.65,6.99 13.65,5.4 12.7,4.45 IC3.1
FC1  (via drill 0.3)
  Top 0.15: v31.75,5.4 32.38,6.03 47.62,6.03 48.58,5.08 56.83,5.08 57.47,5.71 IC2.C01
  Bottom 0.15: v31.75,5.4 31.75,10.16 31.11,10.79 29.53,10.79 IC1.F03 27.3,11.11 20,11.11 19.05,10.16 19.05,8.89 18.73,8.57 13.65,8.57 12.06,6.99 IC3.2
FC2
  Top 0.15: IC1.F02 28.89,9.53 30.16,8.26 47.94,8.26 48.58,7.62 48.58,6.03 49.21,5.4 55.56,5.4 56.2,6.03 56.2,7.62 56.52,7.94 59.05,7.94 IC2.D01
GND  (via drill 0.3)
  Top 0.15: IC1.L11 36.12,32.38 35.48,31.75 C5.2 35.48,26.31 34.85,25.68 | IC1.C03 23.18,14.61 23.18,15.48 C4.2
  Top 0.2: C6.- 34.85,25.68
  Bottom 0.15: IC1.B01 18.1,5.71 17.46,5.08 15.24,5.08 13.65,3.49 8.18,3.49 C3.2
  Bottom 0.2: C7.- 65.68,25.4 62.55,25.4 61.59,24.45 C1.2 60.25,23.42 59.05,22.23 IC2.C07 | C2.2 74.85,23.73 75.88,24.77 IC2.L08
  other vias: 38.1,4.13 29.84,2.54 26.99,3.17 24.77,5.4 21.91,3.81 19.68,5.71 63.18,2.86 63.82,6.67
  pour GND: 1.27,42.55 85.41,42.86 85.41,1.59 1.27,1.27
  pour Top (isolate 0.1): 19.37,5.71 19.37,10.16 20,10.79 21.91,10.79 22.54,10.16 22.54,6.03 23.18,5.4 28.89,5.4 29.84,4.45 60.64,4.45 61.28,5.08 61.28,7.3 62.23,8.26 63.5,8.26 64.14,7.62 64.14,3.17 63.5,2.54 27.3,2.54 26.35,3.49 21.59,3.49
J1
  Bottom 0.15: JP1.1 1.59,38.73 0.64,37.78 0.64,26.04 1.91,24.77 IC3.16 3.49,24.77 4.45,23.81 4.45,18.73 4.76,18.42 R3.2
J2
  Bottom 0.15: JP2.1 6.35,29.84 R1.2 IC3.15
R/#W  (via drill 0.3)
  Top 0.15: v78.74,3.17 78.74,11.11 IC2.L03
  Bottom 0.15: IC1.L02 40.01,8.57 40.01,4.76 40.64,4.13 70.17,4.13 71.12,3.17 v78.74,3.17
SIZ0  (via drill 0.3)
  Top 0.15: v28.26,1.91 28.89,1.27 76.2,1.27 76.83,1.91 76.83,8.57 IC2.L02
  Bottom 0.15: IC1.F01 v28.26,1.91
SIZ1
  Top 0.15: IC1.G02 31.75,10.48 49.21,10.48 51.12,8.57 55.88,8.57 56.2,8.89 56.2,10.16 56.52,10.48 56.83,10.48 57.47,11.11 68.26,11.11 68.9,11.75 68.9,12.7 69.22,13.02 74.3,13.02 IC2.K03
STERM  (via drill 0.3)
  Top 0.15: v68.9,10.16 68.9,8.26 IC2.G01
  Bottom 0.15: R5.2 v68.9,10.16
VCC  (via drill 0.3)
  Top 0.15: IC1.E03 25.72,14.92 25.08,15.56 C4.1 25,20.04 25.64,20.68 C6.+ | C5.1 33.73,31.75 33.1,32.38 IC1.G11 | R2.1 v13.65,40.64 | IC2.H03 71.12,11.11 71.12,3.49 71.75,2.86 R6.1
  Bottom 0.15: IC2.K04 75.25,15.24 74.61,15.88 74.3,15.88 73.34,16.83 R4.1 R5.1 | R3.1 v6.35,23.18 R1.1 | C3.1 IC3.24
  Bottom 0.2: IC2.C06 61.28,19.68 61.59,20 C1.1 62.9,20.36 C7.+ | C2.1 74.53,21.98 75.25,21.27 75.25,20.32 75.88,19.68 IC2.L06
  pour VCC: 1.27,42.55 85.41,42.55 85.41,0.95 1.27,1.27

### Text on the board
Top: v1.1 | ADAP030 | TH2017 | Top
Bottom: Bottom | ADAP030
tNames: v1.1